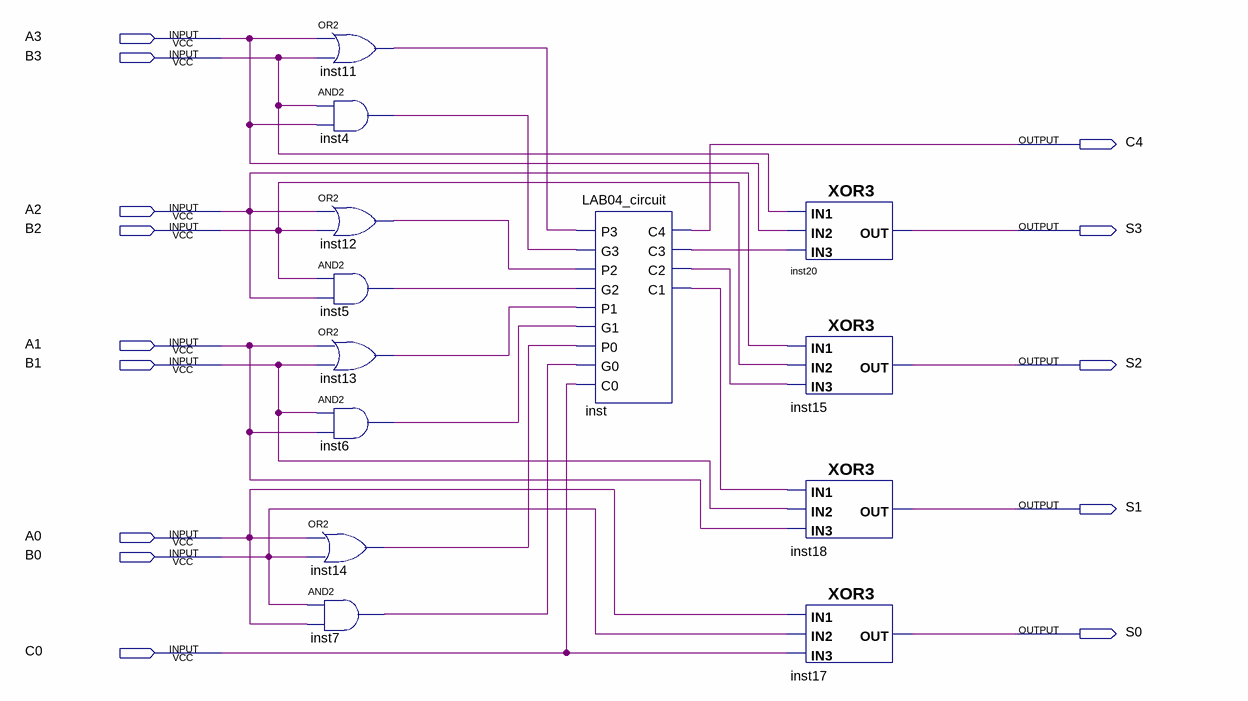
[diagram p0: schematic sheet]
// Quartus schematic LAB04_venha.bdf as structural Verilog: 13 symbols, 14 pins
module LAB04_venha (
  input  A3,
  input  B3,
  input  A2,
  input  B2,
  input  A1,
  input  B1,
  input  A0,
  input  B0,
  input  C0,
  output C4,
  output S3,
  output S2,
  output S1,
  output S0
);

  wire inst4_out, inst5_out, inst6_out, inst7_out, inst11_out, inst12_out, inst13_out, inst14_out, inst_c1,
       inst_c2, inst_c3;

  or inst11 (inst11_out, A3, B3);
  and inst4 (inst4_out, B3, A3);
  or inst12 (inst12_out, A2, B2);
  and inst5 (inst5_out, B2, A2);
  or inst13 (inst13_out, A1, B1);
  and inst6 (inst6_out, B1, A1);
  or inst14 (inst14_out, A0, B0);
  and inst7 (inst7_out, B0, A0);
  LAB04_circuit inst (
    .P3(inst11_out), .G3(inst4_out), .P2(inst12_out), .G2(inst5_out), .P1(inst13_out), .G1(inst6_out),
    .P0(inst14_out), .G0(inst7_out), .C0(C0), .C4(C4), .C3(inst_c3), .C2(inst_c2), .C1(inst_c1));
  XOR3 inst20 (.IN3(inst_c3), .IN1(B3), .IN2(A3), .OUT(S3));
  XOR3 inst15 (.IN3(inst_c2), .IN1(A2), .IN2(B2), .OUT(S2));
  XOR3 inst18 (.IN3(A1), .IN1(inst_c1), .IN2(B1), .OUT(S1));
  XOR3 inst17 (.IN3(C0), .IN1(A0), .IN2(B0), .OUT(S0));
endmodule
